# Altium schematic sheet Trasiente y barrido de parámetros.SchDoc
size A4
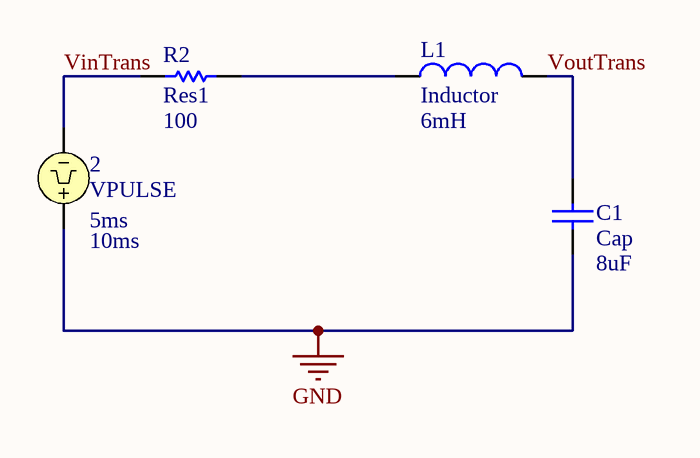
[diagram p0: Trasiente y barrido de parámetros.SchDoc]

## Parts
2  VPULSE  Pulse Width: 5ms  Period: 10ms
C1  Cap  value 8uF  [RAD-0.3]
L1  Inductor  value 6mH  [0402-A]
R2  Res1  value 100  [AXIAL-0.3]

## Nets
GND: 2.1 C1.1
VinTrans: 2.2 R2.1
VoutTrans: C1.2 L1.2
NetL1_1: L1.1 R2.2

## Library data of the parts
2 = VPULSE: Pulse Voltage Source; Note: PCB Footprint - Not required; Published: 8-Jun-2000; LatestRevisionDate: 15-Nov-2004; LatestRevisionNote: Corrected Netlist.; PackageReference: Not Applicable; Publisher: Altium Limited
C1 = Cap: Capacitor; Published: 8-Jun-2000; LatestRevisionDate: 17-Jul-2002; LatestRevisionNote: Re-released for DXP Platform.; PackageReference: RAD-0.3; Publisher: Altium Limited; PackageDescription: Radial Cap, Thru-Hole; 2 Leads; 0.3 in Pin Spacing
L1 = Inductor: Code_IEC: 1005; Published: 8-Jun-2000; LatestRevisionDate: 29-May-2009; LatestRevisionNote: IPC-7351 Footprint Added.; PackageReference: 0402-A; Publisher: Altium Limited; PackageDescription: Chip Inductor; Code_JEITA: 0402
R2 = Res1: Resistor; Published: 8-Jun-2000; LatestRevisionDate: 17-Jul-2002; LatestRevisionNote: Re-released for DXP Platform.; PackageReference: AXIAL-0.3; Publisher: Altium Limited; PackageDescription: Axial Device, Thru-Hole; 2 Leads; 0.3 in Pin Spacing